# Altium schematic sheet POWER.SchDoc: =ProjectName
size A4; CheckedBy: DatNB; Author: Ven; CompanyName: Nacentech; Organization: IMET
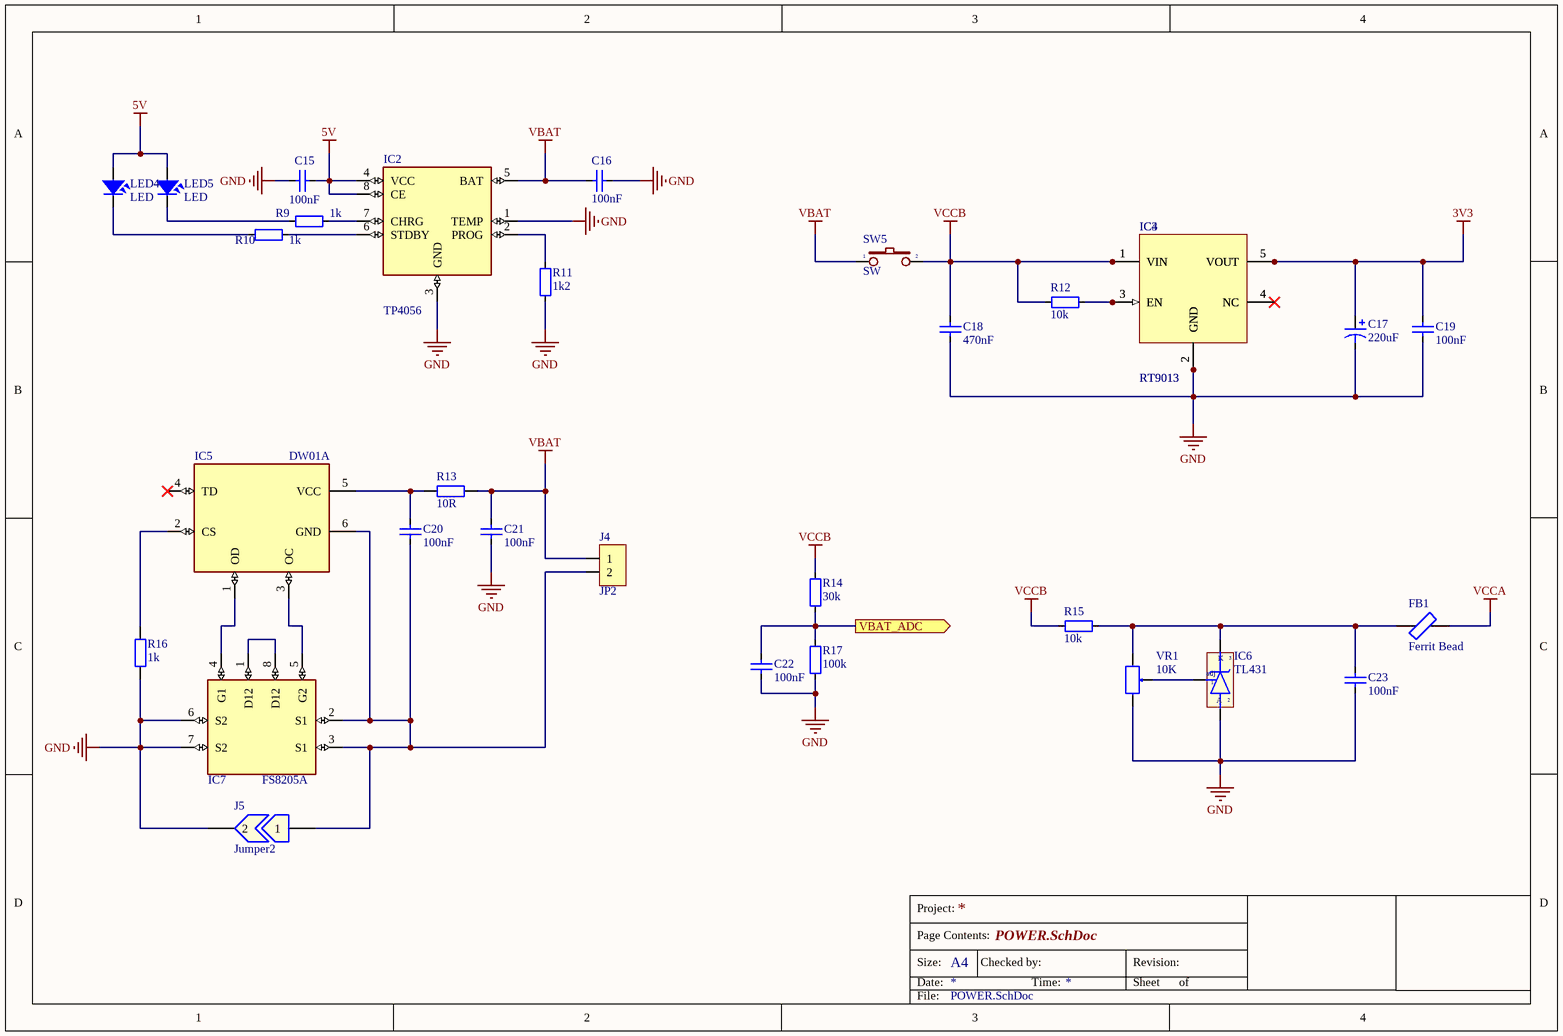
[diagram p0: POWER.SchDoc]

## Parts
C15  100nF  [CAP_0805]
C16  100nF  [CAP_0805]
C17  220uF  [CAP_TANTALUM_3216]
C18  470nF  [CAP_0805]
C19  100nF  [CAP_0805]
C20  100nF  [CAP_0805]
C21  100nF  [CAP_0805]
C22  100nF  [CAP_0805]
C23  100nF  [CAP_0805]
FB1  Ferrit Bead  [RES-SMD-0805]
IC2  TP4056  [TP4056]
IC3  RT9013  [SOT23-5]
IC4  RT9013  [SOT23-5]
IC5  DW01A  [SOT23-6]
IC6  TL431  [qto-92]
IC7  FS8205A  [FS8205A]
J4  JP2  [JP2-D1T]
J5  Jumper2  [RES-SMD-0201]
LED4  LED  [LED-0805-Red]
LED5  LED  [LED-0805-Green]
R9  1k  [RES-SMD-0805]
R10  1k  [RES-SMD-0805]
R11  1k2  [RES-SMD-0805]
R12  10k  [RES-SMD-0805]
R13  10R  [RES-SMD-0805]
R14  30k  [RES-SMD-0805]
R15  10k  [RES-SMD-0805]
R16  1k  [RES-SMD-0805]
R17  100k  [RES-SMD-0805]
SW5  SW  [JP2-D1T]
VR1  10K  [VR1]

## Ports
VBAT_ADC (out)

## Nets
3V3: C17.1 C19.1 IC3.5(VOUT) IC4.5(VOUT)
5V: C15.1 IC2.4(VCC) IC2.8(CE) LED4.1 LED5.1
GND: C15.2 C16.1 C17.2 C18.2 C19.2 C21.1 C22.1 C23.2 IC2.1(TEMP) IC2.3(GND) IC3.2(GND) IC4.2(GND) IC6.2(A) IC7.6(S2) IC7.7(S2) J5.2 R11.1 R16.2 R17.2 VR1.3
VBAT: C16.2 C21.2 IC2.5(BAT) J4.1 R13.2 SW5.1
VCCA: FB1.2
VCCB: C18.1 IC3.1(VIN) IC4.1(VIN) R12.2 R14.1 R15.2 SW5.2
VBAT_ADC: C22.2 R14.2 R17.1 ; port VBAT_ADC
NetC20_1: C20.1 IC5.6(GND) IC7.2(S1) IC7.3(S1) J4.2 J5.1
NetC20_2: C20.2 IC5.5(VCC) R13.1
NetC23_1: C23.1 FB1.1 IC6.3(K) R15.1 VR1.1
NetIC2_2: IC2.2(PROG) R11.2
NetIC2_6: IC2.6(STDBY) R10.1
NetIC2_7: IC2.7(CHRG) R9.1
NetIC3_3: IC3.3(EN) IC4.3(EN) R12.1
NetIC3_4: IC3.4(NC) IC4.4(NC)
NetIC5_1: IC5.1(OD) IC7.4(G1)
NetIC5_2: IC5.2(CS) R16.1
NetIC5_3: IC5.3(OC) IC7.5(G2)
NetIC6_1: IC6.1(adj) VR1.2
NetIC7_1: IC7.1(D12) IC7.8(D12)
NetLED4_2: LED4.2 R10.2
NetLED5_2: LED5.2 R9.2

Not connected (* = marked no-connect by the designer): IC5 4(TD)*

## Notes on the sheet
- Project:
- Page Contents:
- Size:
- Date:
- A4
- Checked by:
- Time:
- Revision:
- Sheet
- of
- File:

## Library data of the parts
C15 C16 C18-C23 = CapSMD: Capacitor; Value: 33p; Published: 8-Jun-2000; LatestRevisionDate: 17-Jul-2002; LatestRevisionNote: Re-released for DXP Platform.; PackageReference: RAD-0.3; Publisher: Altium Limited
C17 = Cap Pol: Polarized Capacitor (Axial); Published: 8-Jun-2000; LatestRevisionDate: 17-Jul-2002; LatestRevisionNote: Re-released for DXP Platform.; PackageReference: POLAR0.8; Publisher: Altium Limited
FB1 = Ferrit Bead: Generic Ferrit Bead
IC2 = TP4056: Complete single cell Li-Ion battery with a constant current / constant voltage linear charger
IC3 IC4 = RT9013: RT9013-33GB IC REG LINEAR 3.3V 500mA SOT23-5
IC5 = DW01A: One Cell Lithium-ion/Polymer Battery Protection IC
IC6 = TL431: Programmable Shunt Regulator; Value: TL431
J4 = JP2: WR-PHD 2.54 mm Angled Socket Header; Manufacturer: W¨¹rth Elektronik eiSos GmbH; partNo: 613002143121; ComponentLink1 Description: Manufacturer; ComponentLink2 Description: Datasheet; NoPins: 02; Created Date: 29 March 2013; ComponentLink1URL: http://www.we-online.com; ComponentLink2URL: http://katalog.we-online.de/em/datasheet/6130xx143121.pdf; Created by: Karrer Zheng
J5 = Jumper2: Jumper, 2-Pin
LED4 LED5 = LED: LED Single colour Green and Red; Value: LED 3 ly Single Colour
R9-R12 R14 R15 R17 = Resistor - SMD: Resistor; Manufacturer: Generic Components; Class: Passive; Published: 08/06/2000; Publisher: Altium Hobart Technology Centre
R13 R16 = Resistor - SMD: Resistor SMD; Manufacturer: Generic Components; Class: Passive; Published: 08/06/2000; Publisher: Altium Hobart Technology Centre
SW5 = SW2: Switch button 2 pin; Value: SW chip 2 pin
VR1 = VR: Var Resistor; Value: VR 10K